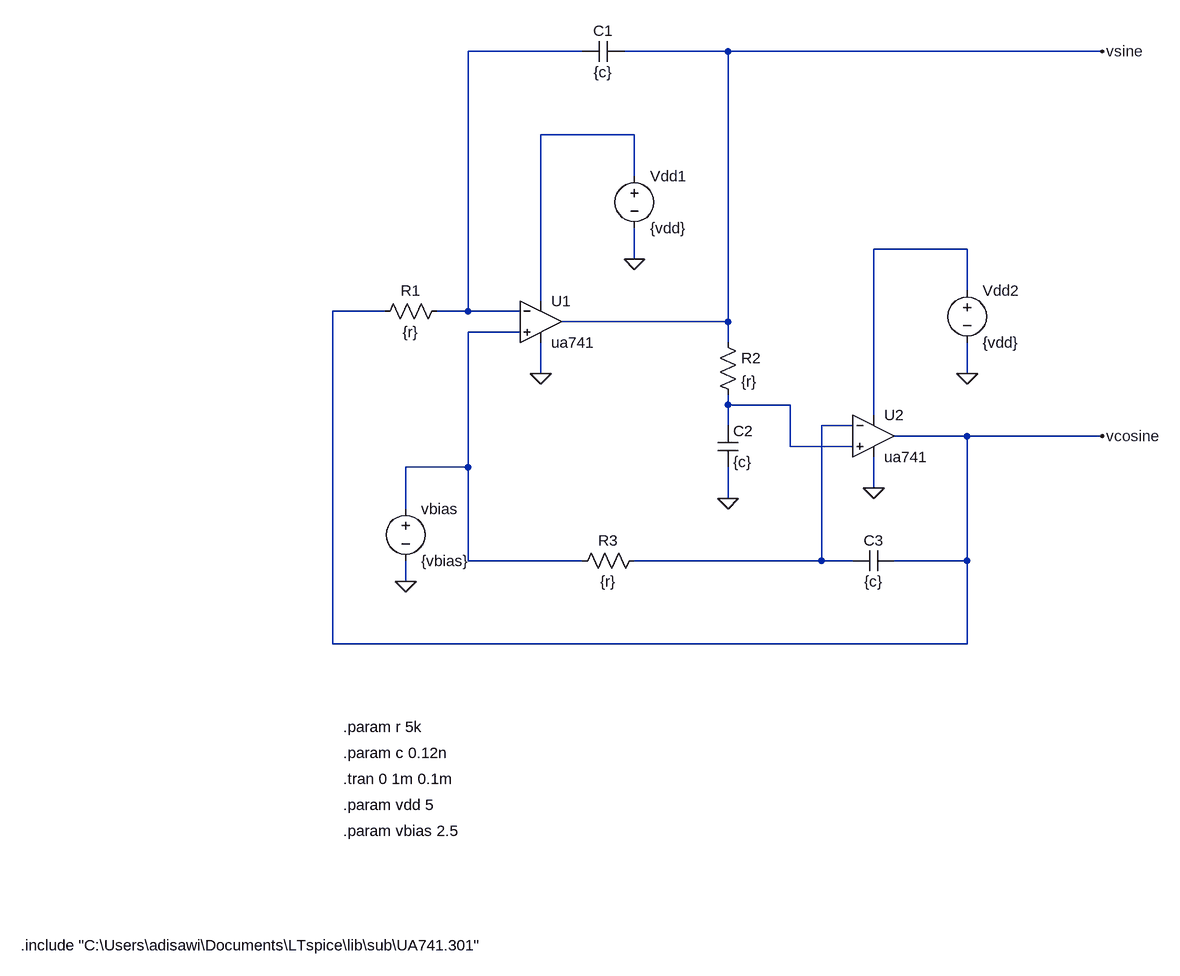
[diagram p0: schematic projosci.asc]
projosci.asc, the LTspice schematic file:
Version 4
SHEET 1 1032 1128
WIRE 128 -288 -48 -288
WIRE 352 -288 192 -288
WIRE 928 -288 352 -288
WIRE 208 -160 64 -160
WIRE 208 -96 208 -160
WIRE 720 16 576 16
WIRE 208 32 208 -16
WIRE 720 80 720 16
WIRE 64 96 64 -160
WIRE -176 112 -256 112
WIRE -48 112 -48 -288
WIRE -48 112 -96 112
WIRE 32 112 -48 112
WIRE 352 128 352 -288
WIRE 352 128 96 128
WIRE 32 144 -48 144
WIRE 352 160 352 128
WIRE 64 208 64 160
WIRE 720 208 720 160
WIRE 352 256 352 240
WIRE 448 256 352 256
WIRE 576 272 576 16
WIRE 352 288 352 256
WIRE 544 288 496 288
WIRE 720 304 608 304
WIRE 928 304 720 304
WIRE 448 320 448 256
WIRE 544 320 448 320
WIRE -48 352 -48 144
WIRE -48 352 -144 352
WIRE 576 384 576 336
WIRE 352 400 352 352
WIRE -144 416 -144 352
WIRE -48 496 -48 352
WIRE 128 496 -48 496
WIRE 496 496 496 288
WIRE 496 496 208 496
WIRE 544 496 496 496
WIRE 720 496 720 304
WIRE 720 496 608 496
WIRE -144 528 -144 496
WIRE -256 624 -256 112
WIRE 720 624 720 496
WIRE 720 624 -256 624
FLAG 208 32 0
FLAG 64 208 0
FLAG 720 208 0
FLAG 576 384 0
FLAG 352 400 0
FLAG -144 528 0
FLAG 928 -288 vsine
FLAG 928 304 vcosine
SYMBOL OpAmps\\opamp2 64 64 R0
SYMATTR InstName U1
SYMATTR Value ua741
SYMBOL voltage 208 -112 R0
WINDOW 123 0 0 Left 0
WINDOW 39 0 0 Left 0
SYMATTR InstName Vdd1
SYMATTR Value {vdd}
SYMBOL cap 192 -304 R90
WINDOW 0 0 32 VBottom 2
WINDOW 3 32 32 VTop 2
SYMATTR InstName C1
SYMATTR Value {c}
SYMBOL res -80 96 R90
WINDOW 0 0 56 VBottom 2
WINDOW 3 32 56 VTop 2
SYMATTR InstName R1
SYMATTR Value {r}
SYMBOL voltage -144 400 R0
SYMATTR InstName vbias
SYMATTR Value {vbias}
SYMBOL res 336 144 R0
SYMATTR InstName R2
SYMATTR Value {r}
SYMBOL OpAmps\\opamp2 576 240 R0
SYMATTR InstName U2
SYMATTR Value ua741
SYMBOL voltage 720 64 R0
WINDOW 123 0 0 Left 0
WINDOW 39 0 0 Left 0
SYMATTR InstName Vdd2
SYMATTR Value {vdd}
SYMBOL cap 336 288 R0
SYMATTR InstName C2
SYMATTR Value {c}
SYMBOL res 224 480 R90
WINDOW 0 0 56 VBottom 2
WINDOW 3 32 56 VTop 2
SYMATTR InstName R3
SYMATTR Value {r}
SYMBOL cap 608 480 R90
WINDOW 0 0 32 VBottom 2
WINDOW 3 32 32 VTop 2
SYMATTR InstName C3
SYMATTR Value {c}
TEXT -736 1088 Left 2 !.include "C:\\Users\\adisawi\\Documents\\LTspice\\lib\\sub\\UA741.301"
TEXT -240 752 Left 2 !.param r 5k
TEXT -240 792 Left 2 !.param c 0.12n
TEXT -240 832 Left 2 !.tran 0 1m 0.1m
TEXT -240 872 Left 2 !.param vdd 5
TEXT -240 912 Left 2 !.param vbias 2.5

The netlist it stands for:
* projosci.asc
XU1 N004 N001 N002 0 vsine ua741  ; pins In+ In- V+ V- OUT
Vdd1 N002 0 {vdd}
C1 vsine N001 {c}
R1 N001 vcosine {r}
vbias N004 0 {vbias}
R2 vsine N005 {r}
XU2 N005 N006 N003 0 vcosine ua741  ; pins In+ In- V+ V- OUT
Vdd2 N003 0 {vdd}
C2 N005 0 {c}
R3 N006 N004 {r}
C3 vcosine N006 {c}
.include "C:\Users\adisawi\Documents\LTspice\lib\sub\UA741.301"
.param r 5k
.param c 0.12n
.tran 0 1m 0.1m
.param vdd 5
.param vbias 2.5
.backanno
.end